# Altium schematic sheet led_2835_driver_circle_10X10cm.SchDoc
size A3; SheetNumber: 1; SheetTotal: 1; SPICEModelCacheLTITHCDH: <root> / <DocumentId>LTITHCDH</DocumentId> / </root>
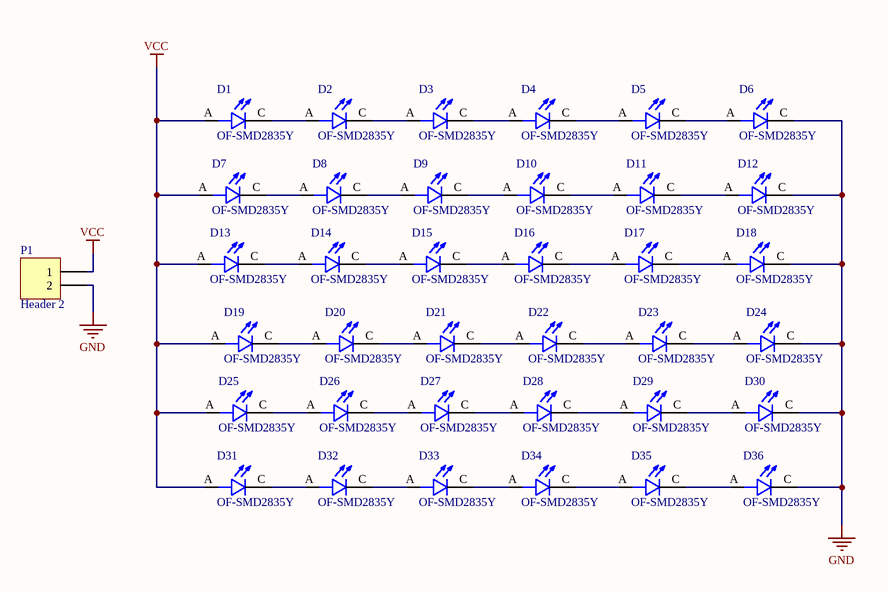
[diagram p0: led_2835_driver_circle_10X10cm.SchDoc]

## Parts
D1  OF-SMD2835Y  [LED_OF-SMD2835Y]
D2  OF-SMD2835Y  [LED_OF-SMD2835Y]
D3  OF-SMD2835Y  [LED_OF-SMD2835Y]
D4  OF-SMD2835Y  [LED_OF-SMD2835Y]
D5  OF-SMD2835Y  [LED_OF-SMD2835Y]
D6  OF-SMD2835Y  [LED_OF-SMD2835Y]
D7  OF-SMD2835Y  [LED_OF-SMD2835Y]
D8  OF-SMD2835Y  [LED_OF-SMD2835Y]
D9  OF-SMD2835Y  [LED_OF-SMD2835Y]
D10  OF-SMD2835Y  [LED_OF-SMD2835Y]
D11  OF-SMD2835Y  [LED_OF-SMD2835Y]
D12  OF-SMD2835Y  [LED_OF-SMD2835Y]
D13  OF-SMD2835Y  [LED_OF-SMD2835Y]
D14  OF-SMD2835Y  [LED_OF-SMD2835Y]
D15  OF-SMD2835Y  [LED_OF-SMD2835Y]
D16  OF-SMD2835Y  [LED_OF-SMD2835Y]
D17  OF-SMD2835Y  [LED_OF-SMD2835Y]
D18  OF-SMD2835Y  [LED_OF-SMD2835Y]
D19  OF-SMD2835Y  [LED_OF-SMD2835Y]
D20  OF-SMD2835Y  [LED_OF-SMD2835Y]
D21  OF-SMD2835Y  [LED_OF-SMD2835Y]
D22  OF-SMD2835Y  [LED_OF-SMD2835Y]
D23  OF-SMD2835Y  [LED_OF-SMD2835Y]
D24  OF-SMD2835Y  [LED_OF-SMD2835Y]
D25  OF-SMD2835Y  [LED_OF-SMD2835Y]
D26  OF-SMD2835Y  [LED_OF-SMD2835Y]
D27  OF-SMD2835Y  [LED_OF-SMD2835Y]
D28  OF-SMD2835Y  [LED_OF-SMD2835Y]
D29  OF-SMD2835Y  [LED_OF-SMD2835Y]
D30  OF-SMD2835Y  [LED_OF-SMD2835Y]
D31  OF-SMD2835Y  [LED_OF-SMD2835Y]
D32  OF-SMD2835Y  [LED_OF-SMD2835Y]
D33  OF-SMD2835Y  [LED_OF-SMD2835Y]
D34  OF-SMD2835Y  [LED_OF-SMD2835Y]
D35  OF-SMD2835Y  [LED_OF-SMD2835Y]
D36  OF-SMD2835Y  [LED_OF-SMD2835Y]
P1  Header 2  [HDR1X2_SMD]

## Nets
GND: D6.C D12.C D18.C D24.C D30.C D36.C P1.2
VCC: D1.A D7.A D13.A D19.A D25.A D31.A P1.1
NetD1_C: D1.C D2.A
NetD2_C: D2.C D3.A
NetD3_C: D3.C D4.A
NetD4_C: D4.C D5.A
NetD5_C: D5.C D6.A
NetD7_C: D7.C D8.A
NetD8_C: D8.C D9.A
NetD9_C: D9.C D10.A
NetD10_C: D10.C D11.A
NetD11_C: D11.C D12.A
NetD13_C: D13.C D14.A
NetD14_C: D14.C D15.A
NetD15_C: D15.C D16.A
NetD16_C: D16.C D17.A
NetD17_C: D17.C D18.A
NetD19_C: D19.C D20.A
NetD20_C: D20.C D21.A
NetD21_C: D21.C D22.A
NetD22_C: D22.C D23.A
NetD23_C: D23.C D24.A
NetD25_C: D25.C D26.A
NetD26_C: D26.C D27.A
NetD27_C: D27.C D28.A
NetD28_C: D28.C D29.A
NetD29_C: D29.C D30.A
NetD31_C: D31.C D32.A
NetD32_C: D32.C D33.A
NetD33_C: D33.C D34.A
NetD34_C: D34.C D35.A
NetD35_C: D35.C D36.A

## Library data of the parts
D1-D36 = OF-SMD2835Y: LED; SMD; 2835, PLCC2; yellow; 2200-2800mcd; 2.8x3.5x0.75mm; 120Â°; Availability: Unavailable; MP: OF-SMD2835Y; Value: *; Package: None; Price: None
P1 = Header 2: Header, 2-Pin; LatestRevisionDate: 17-Jul-2002; LatestRevisionNote: Re-released for DXP Platform.; Publisher: Altium Limited